# Altium schematic sheet TPS75501_3V3B.SchDoc: IDE Connector
size A4; SheetNumber: 1; SheetTotal: 100; Organization: Altium Limited.; Address1: Level 3, 12a Rodborough Rd; Address2: Frenchs Forest 2086; Address3: NSW; Address4: AUSTRALIA
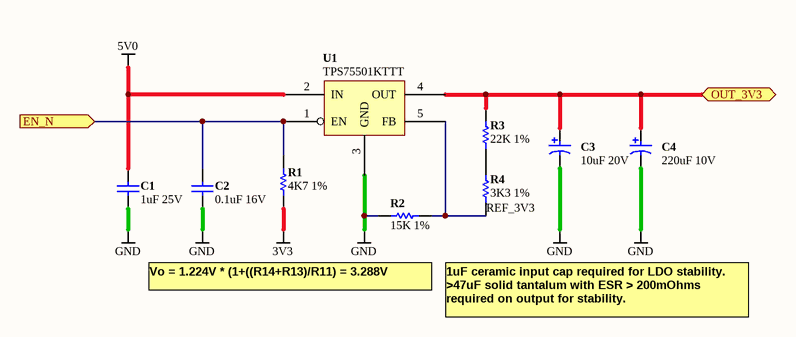
[diagram p0: TPS75501_3V3B.SchDoc]

## Parts
C1  1uF 25V  [CAPC3216-STAR]
C2  0.1uF 16V  [CAPC1005-STAR]
C3  10uF 20V  [CAPC3528-STAR]
C4  220uF 10V  [CAPC7343-STAR]
R1  4K7 1%  [RESC1005-STAR]
R2  15K 1%  [RESC1005-STAR]
R3  22K 1%  [RESC1005-STAR]
R4  3K3 1%  [RESC1005-STAR]
U1  TPS75501KTTT  [TO-263]

## Ports
EN_N (in), OUT_3V3

## Nets
3V3: R1.2
5V0: C1.1 U1.2(IN)
GND: C1.2 C2.2 C3.2 C4.2 R2.1 U1.3(GND)
EN_N: C2.1 R1.1 U1.1(EN) ; port EN_N
OUT_3V3: C3.1 C4.1 R3.2 U1.4(OUT) ; port OUT_3V3
REF_3V3: R2.2 R4.1 U1.5(FB)
NetR3_1: R3.1 R4.2

## Notes on the sheet
- Vo = 1.224V * (1+((R14+R13)/R11) = 3.288V
- 1uF ceramic input cap required for LDO stability.
  >47uF solid tantalum with ESR > 200mOhms required on output for stability.
- Title
- Size:
- Date:
- A4
- Number:
- Time:
- Revision:
- Sheet
- of
- File:

## Library data of the parts
C1 = D-101-0027: Capacitor, Ceramic, 1uF 10% 25V 1206 (3216) X7R; Polarity: Non-Polarized; Capacitance: 1 uF; Dielectric: X7R; Mounting Technology: Surface Mount; Rated Voltage: 25 V; Status: Production; Technology: Ceramic; Tolerance: 10 %; Category: Capacitor
C2 = D-101-0080: Capacitor, Ceramic, 0.1uF 10% 16V 0402 (1005) X7R; Polarity: Non-Polarized; Capacitance: 0.1 uF; Dielectric: X7R; Mounting Technology: Surface Mount; Rated Voltage: 16 V; Status: Production; Technology: Ceramic; Tolerance: 10 %; Category: Capacitor
C3 = D-101-0007: Capacitor, Tantalum, 10uF 10% 20V MCCT-B (3528); Polarity: Polarized; Category: Capacitor; Capacitance: 10 uF; Mounting Technology: Surface Mount; Rated Voltage: 20 V; Status: Production; Technology: Tantalum; Tolerance: 10 %
C4 = D-101-0088: Capacitor, Tantalum, 220uF 10% 10V MCCT-D (7343-31); Polarity: Polarized; Category: Capacitor; Capacitance: 220 uF; Mounting Technology: Surface Mount; Rated Voltage: 10 V; Status: Unreleased; Technology: Tantalum; Tolerance: 10 %
R1 = D-100-0088: Resistor, 4K7 1% 0402 (1005); Power Rating: 63 mW; Resistance: 4.7 K; Category: Resistor; Mounting Technology: Surface Mount; Status: Production; Tolerance: 1 %
R2 = D-100-0125: Resistor, 15K 1% 0402 (1005); Power Rating: 63 mW; Category: Resistor; Mounting Technology: Surface Mount; Resistance: 15 K; Status: Production; Tolerance: 1 %
R3 = D-100-0114: Resistor, 22K 1% 0402 (1005); Power Rating: mW; Category: Resistor; Mounting Technology: Surface Mount; Resistance: 22 K; Status: Production; Tolerance: 1 %
R4 = D-100-0098: Resistor, 3K3 1% 0402 (1005); Power Rating: 63 mW; Resistance: 3.3 K; Category: Resistor; Mounting Technology: Surface Mount; Status: Production; Tolerance: 1 %
U1 = D-204-0014: TPS75501KTTT, 5A, Low Dropout, Adjustable, Linear Voltage Regulator, TO-263; Max Input Voltage: 6 V; Max Output Voltage: 5.5 V; Min Input Voltage: 1 V; Supply Voltage: mV; Max Output Current: 5 A; Min Output Voltage: 1 V; Mounting Technology: Surface Mount; Status: Production; Temperature Range: -40 to +125; Category: IC-Power